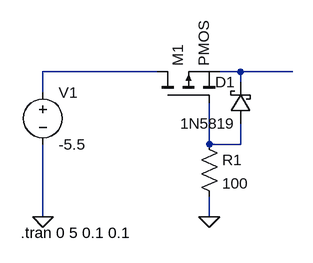
[diagram p0: schematic Input Voltage Polarity Protection.asc]
Input Voltage Polarity Protection.asc, the LTspice schematic file:
Version 4
SHEET 1 880 680
WIRE 176 64 0 64
WIRE 304 64 272 64
WIRE 384 64 304 64
WIRE 304 80 304 64
WIRE 0 96 0 64
WIRE 256 176 256 112
WIRE 304 176 304 144
WIRE 304 176 256 176
WIRE 0 288 0 176
WIRE 256 288 256 256
FLAG 256 288 0
FLAG 0 288 0
SYMBOL pmos 176 112 R270
SYMATTR InstName M1
SYMBOL res 240 160 R0
SYMATTR InstName R1
SYMATTR Value 100
SYMBOL voltage 0 80 R0
WINDOW 123 0 0 Left 0
WINDOW 39 0 0 Left 0
SYMATTR InstName V1
SYMATTR Value -5.5
SYMBOL schottky 320 144 R180
WINDOW 0 24 64 Left 2
WINDOW 3 24 0 Left 2
SYMATTR InstName D1
SYMATTR Value 1N5819
SYMATTR Description Zener Diode
SYMATTR Type zener
TEXT -34 312 Left 2 !.tran 0 5 0.1 0.1

The netlist it stands for:
* Input Voltage Polarity Protection.asc
M1 N001 N003 N002 N002 PMOS
R1 N003 0 100
V1 N001 0 -5.5
D1 N003 N002 1N5819
.model D D
.lib standard.dio
.model NMOS NMOS
.model PMOS PMOS
.lib standard.mos
.tran 0 5 0.1 0.1
.backanno
.end